# Altium schematic sheet Esquematico.SchDoc
size A4
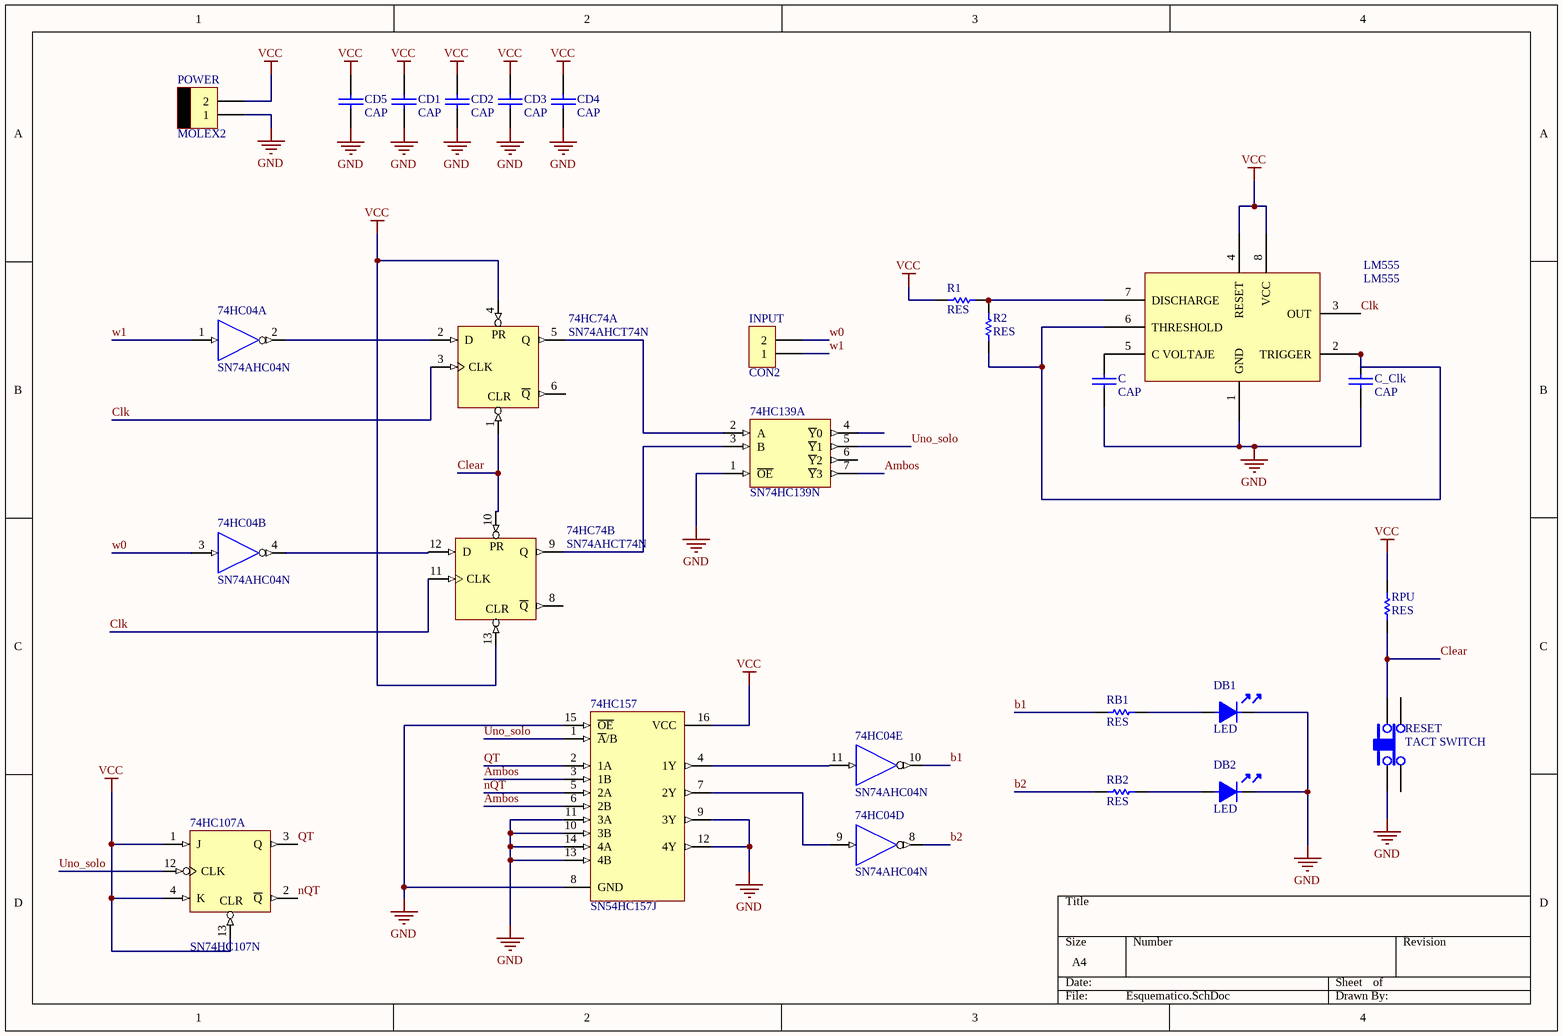
[diagram p0: Esquematico.SchDoc]

## Parts
74HC04  SN74AHC04N  [N014]  (parts A,B,D,E of 6)
74HC74  SN74AHCT74N  [N014]  (parts A,B of 2)
74HC107  SN74HC107N  [N014D]  (part A of 2)
74HC139  SN74HC139N  [N016]  (part A of 2)
74HC157  SN54HC157J  [J016]
C  CAP  [CAP200]
C_Clk  CAP  [CAP200]
CD1  CAP  [CAP200]
CD2  CAP  [CAP200]
CD3  CAP  [CAP200]
CD4  CAP  [CAP200]
CD5  CAP  [CAP200]
DB1  LED  [LED3]
DB2  LED  [LED3]
INPUT  CON2  [SIP2]
LM555  LM555  [DIP8]
POWER  MOLEX2  [MOLEX2]
R1  RES  [RES400]
R2  RES  [RES400]
RB1  RES  [RES400]
RB2  RES  [RES400]
RESET  TACT SWITCH  [TACTSWITCH]
RPU  RES  [RES400]

## Nets
GND: 74HC04.7(GND) 74HC74.7(GND) 74HC107.7(GND) 74HC139.1(~{OE}) 74HC139.8(GND) 74HC157.8(GND) 74HC157.9(3Y) 74HC157.10(3B) 74HC157.11(3A) 74HC157.12(4Y) 74HC157.13(4B) 74HC157.14(4A) 74HC157.15(~{OE}) C.2 C_Clk.2 CD1.2 CD2.2 CD3.2 CD4.2 CD5.2 DB1.2 DB2.2 LM555.1(GND) POWER.1 RESET.1
VCC: 74HC04.14(VCC) 74HC74.4(PR) 74HC74.13(CLR) 74HC74.14(VCC) 74HC107.1(J) 74HC107.4(K) 74HC107.13(CLR) 74HC107.14(VCC) 74HC139.16(VCC) 74HC157.16(VCC) CD1.1 CD2.1 CD3.1 CD4.1 CD5.1 LM555.4(RESET) LM555.8(VCC) POWER.2 R1.1 RPU.2
Ambos: 74HC139.7(~{Y}3) 74HC157.3(1B) 74HC157.6(2B)
b1: 74HC04.10(Y) RB1.1
b2: 74HC04.8(Y) RB2.1
Clear: 74HC74.1(CLR) 74HC74.10(PR) RESET.3 RPU.1
Clk: 74HC74.3(CLK) 74HC74.11(CLK) LM555.3(OUT)
nQT: 74HC107.2(~{Q}) 74HC157.5(2A)
QT: 74HC107.3(Q) 74HC157.2(1A)
Uno_solo: 74HC107.12(CLK) 74HC139.5(~{Y}1) 74HC157.1(~{A}/B)
w0: 74HC04.3(A) INPUT.2
w1: 74HC04.1(A) INPUT.1
Net74HC04_2: 74HC04.2(Y) 74HC74.2(D)
Net74HC04_4: 74HC04.4(Y) 74HC74.12(D)
Net74HC04_9: 74HC04.9(A) 74HC157.7(2Y)
Net74HC04_11: 74HC04.11(A) 74HC157.4(1Y)
Net74HC74_5: 74HC74.5(Q) 74HC139.2(A)
Net74HC74_9: 74HC74.9(Q) 74HC139.3(B)
NetC_1: C.1 LM555.5(C_VOLTAJE)
NetC_Clk_1: C_Clk.1 LM555.2(TRIGGER) LM555.6(THRESHOLD) R2.1
NetDB1_1: DB1.1 RB1.2
NetDB2_1: DB2.1 RB2.2
NetLM555_7: LM555.7(DISCHARGE) R1.2 R2.2

Not connected (* = marked no-connect by the designer): 74HC74 6(~{Q}) 8(~{Q}); 74HC139 4(~{Y}0) 6(~{Y}2); RESET 2 4

## Library data of the parts
74HC04 = SN74AHC04N: Hex Inverter; Published: 8-Jun-2000; LatestRevisionDate: 04-Mar-2005; LatestRevisionNote: Stylized 3D Model Added.; DatasheetVersion: Jun-1998; PackageVersion: Oct-1995; PackageReference: N014; Publisher: Altium Limited; PackageDescription: DIP; 14 Leads; Row Spacing 7.62 mm; Pitch 2.54 mm; ComponentLink1Description: Manufacturer Link; ComponentLink1URL: http://www.ti.com/; ComponentLink2Description: Datasheet; ComponentLink2URL: http://www-s.ti.com/sc/ds/sn74ahc04.pdf; ComponentLink3Description: Packaging Specification; ComponentLink3URL: http://focus.ti.com/lit/ml/mpdi002c/mpdi002c.pdf
74HC74 = SN74AHCT74N: Dual Positive-Edge-Triggered D-Type Flip-Flop with Clear and Preset; Published: 8-Jun-2000; LatestRevisionDate: 04-Mar-2005; LatestRevisionNote: Stylized 3D Model Added.; DatasheetVersion: Oct-1998; PackageVersion: Oct-1995; PackageReference: N014; Publisher: Altium Limited; PackageDescription: DIP; 14 Leads; Row Spacing 7.62 mm; Pitch 2.54 mm; ComponentLink1Description: Manufacturer Link; ComponentLink1URL: http://www.ti.com/; ComponentLink2Description: Datasheet; ComponentLink2URL: http://www-s.ti.com/sc/ds/sn74ahct74.pdf
74HC107 = SN74HC107N: Dual J-K Negative-Edge-Triggered Flip-Flop with Clear; Published: 8-Jun-2000; LatestRevisionDate: 04-Mar-2005; LatestRevisionNote: Stylized 3D Model Added.; DatasheetVersion: Jun-1989; PackageVersion: Oct-1995; PackageReference: N014D; Publisher: Altium Limited; PackageDescription: DIP; 14 Leads; Row Spacing 7.62 mm; Pitch 2.54 mm; ComponentLink1Description: Manufacturer Link; ComponentLink1URL: http://www.ti.com/
74HC139 = SN74HC139N: Dual 2-Line to 4-Line Decoder / Demultiplexer; Published: 8-Jun-2000; LatestRevisionDate: 04-Mar-2005; LatestRevisionNote: Stylized 3D Model Added.; DatasheetVersion: May-1997; PackageVersion: Oct-1995; PackageReference: N016; Publisher: Altium Limited; PackageDescription: DIP; 16 Leads; Row Spacing 7.62 mm; Pitch 2.54 mm; Code_JEDEC: MS-001-BB; ComponentLink1Description: Manufacturer Link; ComponentLink1URL: http://www.ti.com/; ComponentLink2Description: Datasheet; ComponentLink2URL: http://www-s.ti.com/sc/ds/sn74hc139.pdf
74HC157 = SN54HC157J: Quadraple 2-Line to 1-Line Data Selector/Multiplexer; Published: 8-Jun-2000; LatestRevisionDate: 04-Mar-2005; LatestRevisionNote: Stylized 3D Model Added.; DatasheetVersion: May-1997; PackageVersion: Jun-1999; PackageReference: J016; Publisher: Altium Limited; PackageDescription: DIP; 16 Leads; Row Spacing 7.62 mm; Pitch 2.54 mm; ComponentLink1Description: Manufacturer Link; ComponentLink1URL: http://www.ti.com/; ComponentLink2Description: Datasheet; ComponentLink2URL: http://www-s.ti.com/sc/ds/sn74hc157.pdf
LM555 = LM555: Timer